# EAGLE design STM32F417 module (EAGLE 8.1.1)
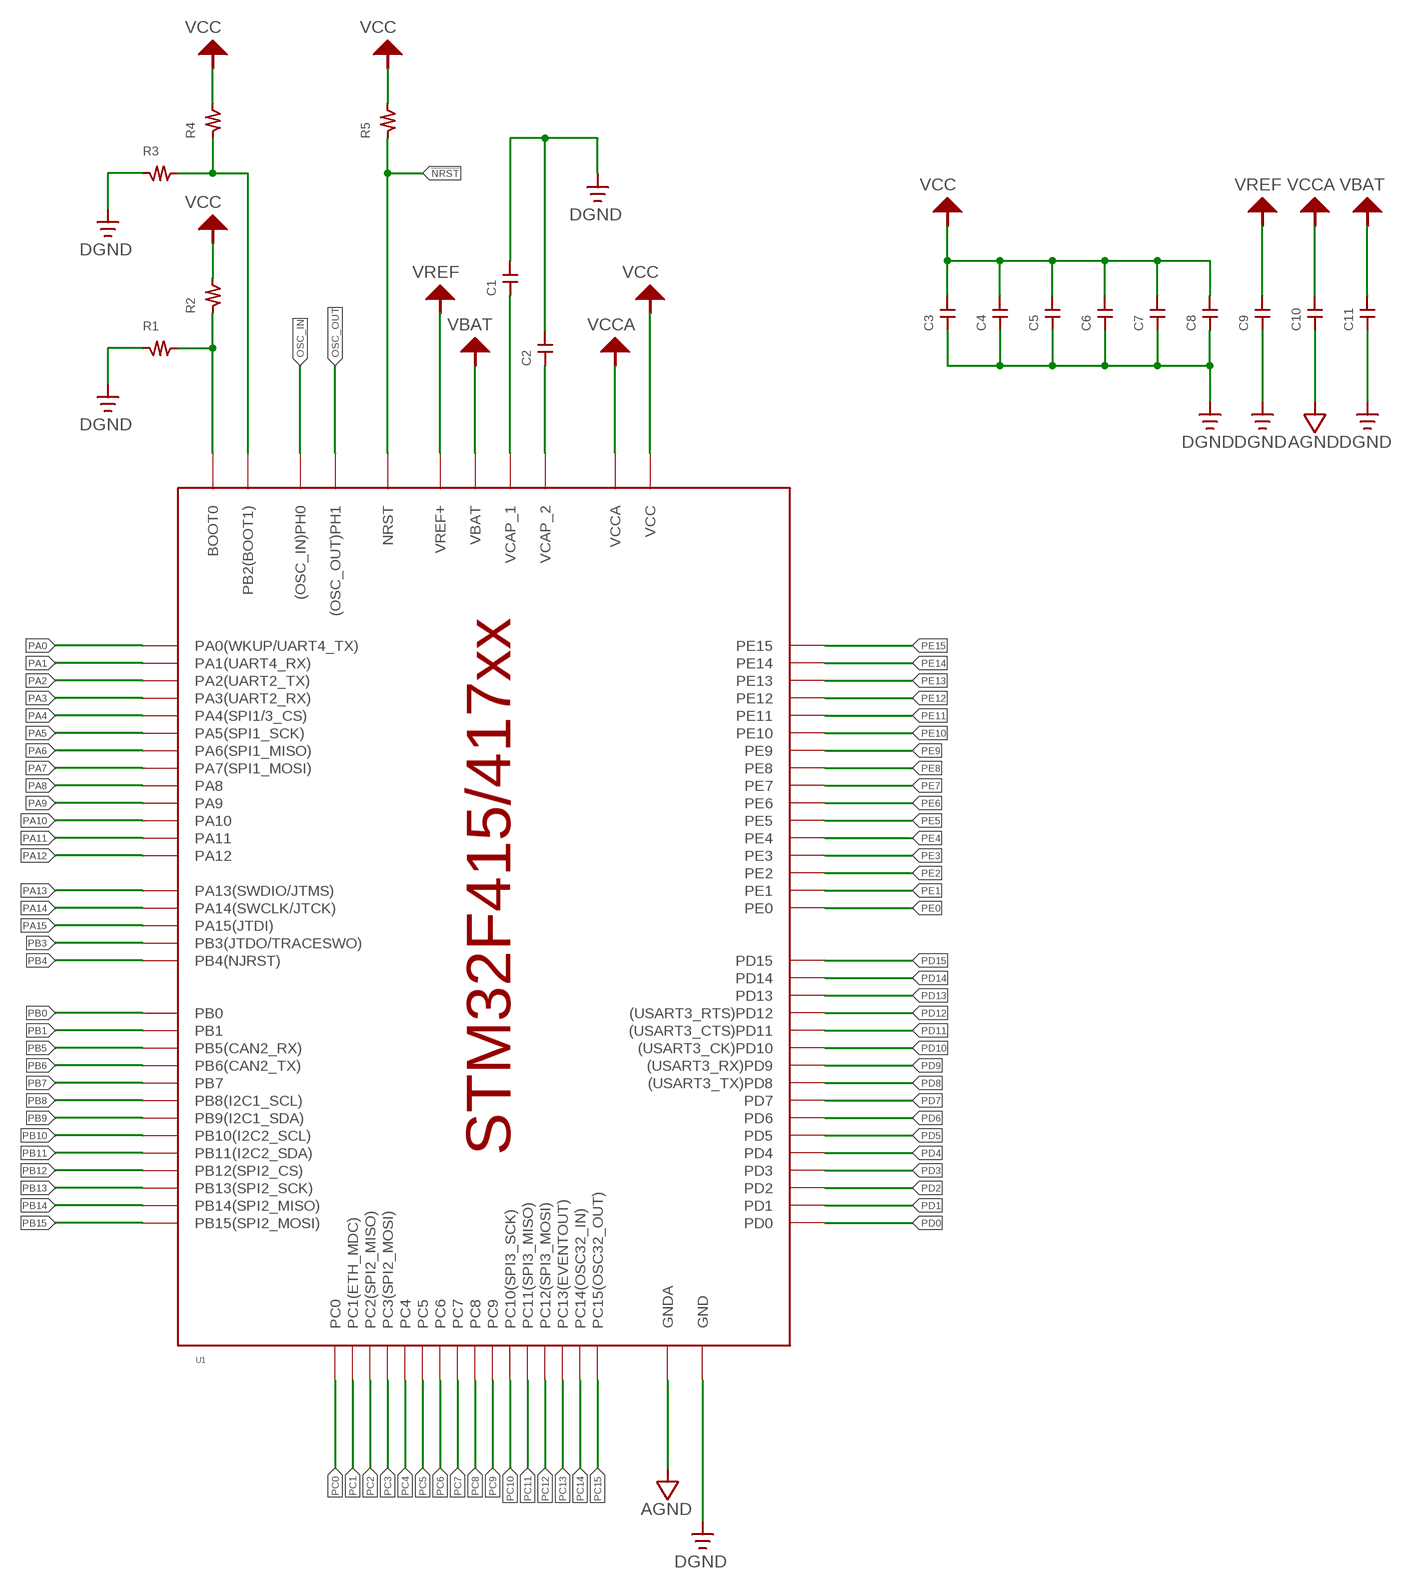
[diagram p0: schematic, sheet 1]

## Parts
C1  CAPACITOR_CHIP2012  [2012]
C2  CAPACITOR_CHIP2012  [2012]
C3  CAPACITOR_CHIP2012  [2012]
C4  CAPACITOR_CHIP2012  [2012]
C5  CAPACITOR_CHIP2012  [2012]
C6  CAPACITOR_CHIP2012  [2012]
C7  CAPACITOR_CHIP2012  [2012]
C8  CAPACITOR_CHIP2012  [2012]
C9  CAPACITOR_CHIP2012  [2012]
C10  CAPACITOR_CHIP2012  [2012]
C11  CAPACITOR_CHIP2012  [2012]
R1  RESISTOR_CHIP_2012  [2012]
R2  RESISTOR_CHIP_2012  [2012]
R3  RESISTOR_CHIP_2012  [2012]
R4  RESISTOR_CHIP_2012  [2012]
R5  RESISTOR_CHIP_2012  [2012]
U1  STM32F415/417  [LQFP100]

## Nets
!NRST: R5.P$1 U1.P$14(NRST)
AGND: C10.P$1 U1.P$20(GNDA)
BOOT0: R1.P$2 R2.P$1 U1.P$94(BOOT0)
BOOT1: R3.P$2 R4.P$1 U1.P$37(PB2(BOOT1))
DGND: C1.P$2 C2.P$2 C3.P$1 C4.P$1 C5.P$1 C6.P$1 C7.P$1 C8.P$1 C9.P$1 C11.P$1 R1.P$1 R3.P$1 U1.P$10(GND) U1.P$27(GND) U1.P$74(GND) U1.P$99(GND)
OSC_IN: U1.P$12((OSC_IN)PH0)
OSC_OUT: U1.P$13((OSC_OUT)PH1)
PA0: U1.P$23(PA0(WKUP/UART4_TX))
PA1: U1.P$24(PA1(UART4_RX))
PA2: U1.P$25(PA2(UART2_TX))
PA3: U1.P$26(PA3(UART2_RX))
PA4: U1.P$29(PA4(SPI1/3_CS))
PA5: U1.P$30(PA5(SPI1_SCK))
PA6: U1.P$31(PA6(SPI1_MISO))
PA7: U1.P$32(PA7(SPI1_MOSI))
PA8: U1.P$67(PA8)
PA9: U1.P$68(PA9)
PA10: U1.P$69(PA10)
PA11: U1.P$70(PA11)
PA12: U1.P$71(PA12)
PA13: U1.P$72(PA13(SWDIO/JTMS))
PA14: U1.P$76(PA14(SWCLK/JTCK))
PA15: U1.P$77(PA15(JTDI))
PB0: U1.P$35(PB0)
PB1: U1.P$36(PB1)
PB3: U1.P$89(PB3(JTDO/TRACESWO))
PB4: U1.P$90(PB4(NJRST))
PB5: U1.P$91(PB5(CAN2_RX))
PB6: U1.P$92(PB6(CAN2_TX))
PB7: U1.P$93(PB7)
PB8: U1.P$95(PB8(I2C1_SCL))
PB9: U1.P$96(PB9(I2C1_SDA))
PB10: U1.P$47(PB10(I2C2_SCL))
PB11: U1.P$48(PB11(I2C2_SDA))
PB12: U1.P$51(PB12(SPI2_CS))
PB13: U1.P$52(PB13(SPI2_SCK))
PB14: U1.P$53(PB14(SPI2_MISO))
PB15: U1.P$54(PB15(SPI2_MOSI))
PC0: U1.P$15(PC0)
PC1: U1.P$16(PC1(ETH_MDC))
PC2: U1.P$17(PC2(SPI2_MISO))
PC3: U1.P$18(PC3(SPI2_MOSI))
PC4: U1.P$33(PC4)
PC5: U1.P$34(PC5)
PC6: U1.P$63(PC6)
PC7: U1.P$64(PC7)
PC8: U1.P$65(PC8)
PC9: U1.P$66(PC9)
PC10: U1.P$78(PC10(SPI3_SCK))
PC11: U1.P$79(PC11(SPI3_MISO))
PC12: U1.P$80(PC12(SPI3_MOSI))
PC13: U1.P$7(PC13(EVENTOUT))
PC14: U1.P$8(PC14(OSC32_IN))
PC15: U1.P$9(PC15(OSC32_OUT))
PD0: U1.P$81(PD0)
PD1: U1.P$82(PD1)
PD2: U1.P$83(PD2)
PD3: U1.P$84(PD3)
PD4: U1.P$85(PD4)
PD5: U1.P$86(PD5)
PD6: U1.P$87(PD6)
PD7: U1.P$88(PD7)
PD8: U1.P$55((USART3_TX)PD8)
PD9: U1.P$56((USART3_RX)PD9)
PD10: U1.P$57((USART3_CK)PD10)
PD11: U1.P$58((USART3_CTS)PD11)
PD12: U1.P$59((USART3_RTS)PD12)
PD13: U1.P$60(PD13)
PD14: U1.P$61(PD14)
PD15: U1.P$62(PD15)
PE0: U1.P$97(PE0)
PE1: U1.P$98(PE1)
PE2: U1.P$1(PE2)
PE3: U1.P$2(PE3)
PE4: U1.P$3(PE4)
PE5: U1.P$4(PE5)
PE6: U1.P$5(PE6)
PE7: U1.P$38(PE7)
PE8: U1.P$39(PE8)
PE9: U1.P$40(PE9)
PE10: U1.P$41(PE10)
PE11: U1.P$42(PE11)
PE12: U1.P$43(PE12)
PE13: U1.P$44(PE13)
PE14: U1.P$45(PE14)
PE15: U1.P$46(PE15)
VBAT: C11.P$2 U1.P$6(VBAT)
VCAP1: C1.P$1 U1.P$49(VCAP_1)
VCAP2: C2.P$1 U1.P$73(VCAP_2)
VCC: C3.P$2 C4.P$2 C5.P$2 C6.P$2 C7.P$2 C8.P$2 R2.P$2 R4.P$2 R5.P$2 U1.P$11(VCC) U1.P$19(VCC) U1.P$28(VCC) U1.P$50(VCC) U1.P$75(VCC) U1.P$100(VCC)
VCCA: C10.P$2 U1.P$22(VCCA)
VREF: C9.P$2 U1.P$21(VREF+)

## Library data of the parts
C1-C11 = passive:CAPACITOR_CHIP
R1-R5 = passive:RESISTOR_CHIP_
U1 = ST-MCU:STM32F415/417

## Board
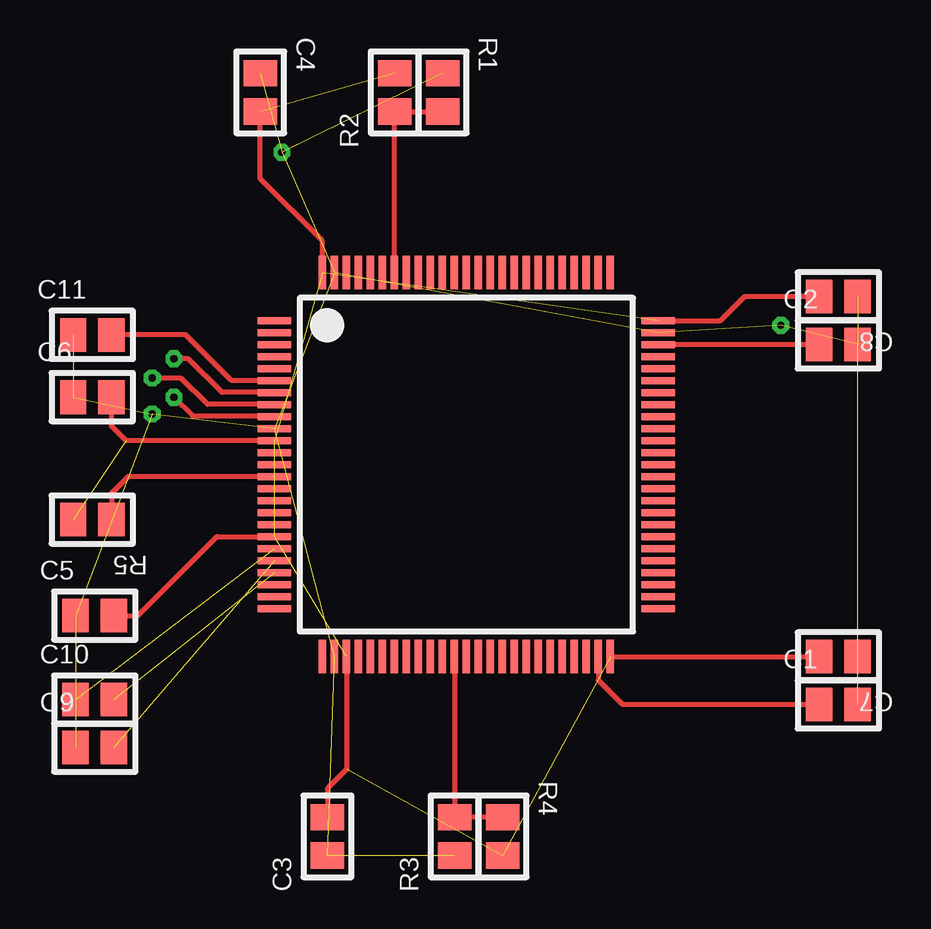
[diagram p1: board, top side]

No outline drawn. Coordinates in mm, seen from the top.
Copper layers (1*16): Top 0.035mm / dielectric 1.5mm / Bottom 0.035mm
Design rules "default": minimum track width 10mil, minimum drill 24mil, track to track 8mil, track to pad 8mil, pad to pad 8mil, via to via 8mil, smd to smd 8mil, copper to edge 40mil, drill to drill 8mil, minimum pad ring 10mil, minimum via ring 8mil, stop-mask expansion 4mil, vias tented up to drill 0mil, thermal gap 10mil

### Footprints (pad centres in the part's own frame; a part is rotated, then mirrored left to right if it is on the bottom)
2012 = smd 1.4 x 1.1: P$1 0,0.8; P$2 0,-0.8
LQFP100 = smd 0.3 x 1.4: P$1 -6,-8; P$2 -5.5,-8; P$3 -5,-8; P$4 -4.5,-8; P$5 -4,-8; P$6 -3.5,-8; P$7 -3,-8; P$8 -2.5,-8; P$9 -2,-8; P$10 -1.5,-8; P$11 -1,-8; P$12 -0.5,-8; P$13 0,-8; P$14 0.5,-8; P$15 1,-8; P$16 1.5,-8; P$17 2,-8; P$18 2.5,-8; P$19 3,-8; P$20 3.5,-8; P$21 4,-8; P$22 4.5,-8; P$23 5,-8; P$24 5.5,-8; P$25 6,-8; P$51 6,8; P$52 5.5,8; P$53 5,8; P$54 4.5,8; P$55 4,8; P$56 3.5,8; P$57 3,8; P$58 2.5,8; P$59 2,8; P$60 1.5,8; P$61 1,8; P$62 0.5,8; P$63 0,8; P$64 -0.5,8; P$65 -1,8; P$66 -1.5,8; P$67 -2,8; P$68 -2.5,8; P$69 -3,8; P$70 -3.5,8; P$71 -4,8; P$72 -4.5,8; P$73 -5,8; P$74 -5.5,8; P$75 -6,8 | smd 1.4 x 0.3: P$26 8,-6; P$27 8,-5.5; P$28 8,-5; P$29 8,-4.5; P$30 8,-4; P$31 8,-3.5; P$32 8,-3; P$33 8,-2.5; P$34 8,-2; P$35 8,-1.5; P$36 8,-1; P$37 8,-0.5; P$38 8,0; P$39 8,0.5; P$40 8,1; P$41 8,1.5; P$42 8,2; P$43 8,2.5; P$44 8,3; P$45 8,3.5; P$46 8,4; P$47 8,4.5; P$48 8,5; P$49 8,5.5; P$50 8,6; P$76 -8,6; P$77 -8,5.5; P$78 -8,5; P$79 -8,4.5; P$80 -8,4; P$81 -8,3.5; P$82 -8,3; P$83 -8,2.5; P$84 -8,2; P$85 -8,1.5; P$86 -8,1; P$87 -8,0.5; P$88 -8,0; P$89 -8,-0.5; P$90 -8,-1; P$91 -8,-1.5; P$92 -8,-2; P$93 -8,-2.5; P$94 -8,-3; P$95 -8,-3.5; P$96 -8,-4; P$97 -8,-4.5; P$98 -8,-5; P$99 -8,-5.5; P$100 -8,-6

### Placement (x,y rotation side)
C1  23.5,-16 90 top
C2  23.5,-1 90 top
C3  2.2,-21.5 180 top
C4  -0.6,9.5 0 top
C5  -7.5,-12.3 90 top
C6  -7.6,-3.2 90 top
C7  23.5,-14 270 top
C8  23.5,1 270 top
C9  -7.5,-17.8 90 top
C10  -7.5,-15.8 90 top
C11  -7.6,-0.6 90 top
R1  7,9.5 0 top
R2  5,9.5 180 top
R3  7.5,-21.5 180 top
R4  9.5,-21.5 0 top
R5  -7.6,-8.3 270 top
U1  7.99,-6.01 270 top

### Tracks (layer width: path | path; a pad name or v marks a point on that pad's centre or on a via)
!NRST
  Top 0.2: U1.P$14 -6.11,-6.51 -6.8,-7.2 R5.P$1
AGND  (1 unrouted)
BOOT0
  Top 0.2: U1.P$94 R2.P$1 R1.P$2
BOOT1  (1 unrouted)
  Top 0.2: U1.P$37 R3.P$2 | R4.P$1 R3.P$2
DGND  (via drill 0.3)  (18 unrouted)
  other vias: -5.1,-3.9 21.1,-0.2 0.3,7
N$2  (via drill 0.3)
  Top 0.2: 0,-3.5 -2.8,-3.5 -3.9,-2.4 v-5.1,-2.4
N$3  (via drill 0.3)
  Top 0.2: 0.1,-3 -2.2,-3 -3.6,-1.6 v-4.2,-1.6
N$4  (via drill 0.3)
  Top 0.2: 0,-4 -3.4,-4 v-4.2,-3.2
VBAT
  Top 0.2: U1.P$6 -1.79,-2.51 -3.7,-0.6 C11.P$2
VCAP1
  Top 0.2: U1.P$49 13.49,-14.99 14.5,-16 C1.P$1
VCAP2
  Top 0.2: U1.P$73 C2.P$1
VCC  (8 unrouted)
  Top 0.2: U1.P$11 -6.19,-5.01 -6.8,-4.4 C6.P$2 | C5.P$2 -5.7,-12.3 -2.41,-9.01 U1.P$19 | U1.P$28 2.99,-18.71 2.2,-19.5 C3.P$2 | U1.P$75 18.59,-0.01 19.6,1 C8.P$2 | U1.P$100 1.99,3.31 -0.6,5.9 C4.P$2 | U1.P$50 C7.P$2
VCCA  (1 unrouted)
VREF  (1 unrouted)